# Altium project 03-LcdSegment.PrjPcb
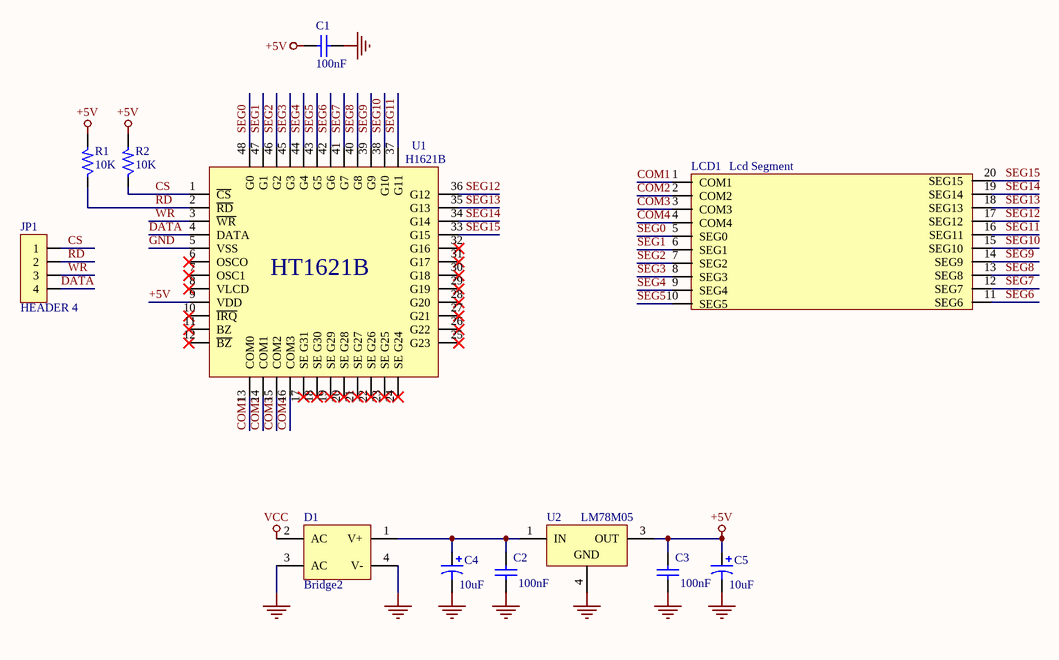
[diagram p0: 03-LcdSegment.SchDoc]
1 sheet, 12 parts. Net scope: global (net labels, ports and power ports of the same name join across sheets).
Board file: 03-LcdSegment.PcbDoc

## Sheet 03-LcdSegment.SchDoc
size A4

### Parts
C1  value 100nF  [RAD-0.3]  (hidden comment: 104)
C2  value 100nF  [RAD-0.3]  (hidden comment: 104)
C3  value 100nF  [RAD-0.3]  (hidden comment: 104)
C4  value 10uF  [RB7.6-15]  (hidden comment: 10uF/16V)
C5  value 10uF  [RB7.6-15]  (hidden comment: 10uF/16V)
D1  Bridge2  [D-46_6A]
JP1  HEADER 4  [JP4-C1T]
LCD1  Lcd Segment  [LCD_SEG_6]
R1  10K  [RES-0805]
R2  10K  [RES-0805]
U1  H1621B  [LQFP-48]
U2  value LM78M05  [NDP0003B_M]  (hidden comment: LM78M05CDTX)

### Nets
+5V: C1.1 C3.1 C5.1 R1.2 R2.2 U1.9(VDD) U2.3(OUT)
GND: C1.2 C2.2 C3.2 C4.2 C5.2 D1.3(AC) D1.4(V-) U1.5(VSS) U2.4(GND)
VCC: D1.2(AC)
COM1: LCD1.1(COM1) U1.13(COM0)
COM2: LCD1.2(COM2) U1.14(COM1)
COM3: LCD1.3(COM3) U1.15(COM2)
COM4: LCD1.4(COM4) U1.16(COM3)
CS: JP1.1 R2.1 U1.1(~{CS})
DATA: JP1.4 U1.4(DATA)
RD: JP1.2 R1.1 U1.2(~{RD})
SEG0: LCD1.5(SEG0) U1.48(G0)
SEG1: LCD1.6(SEG1) U1.47(G1)
SEG2: LCD1.7(SEG2) U1.46(G2)
SEG3: LCD1.8(SEG3) U1.45(G3)
SEG4: LCD1.9(SEG4) U1.44(G4)
SEG5: LCD1.10(SEG5) U1.43(G5)
SEG6: LCD1.11(SEG6) U1.42(G6)
SEG7: LCD1.12(SEG7) U1.41(G7)
SEG8: LCD1.13(SEG8) U1.40(G8)
SEG9: LCD1.14(SEG9) U1.39(G9)
SEG10: LCD1.15(SEG10) U1.38(G10)
SEG11: LCD1.16(SEG11) U1.37(G11)
SEG12: LCD1.17(SEG12) U1.36(G12)
SEG13: LCD1.18(SEG13) U1.35(G13)
SEG14: LCD1.19(SEG14) U1.34(G14)
SEG15: LCD1.20(SEG15) U1.33(G15)
WR: JP1.3 U1.3(~{WR})
NetC2_1: C2.1 C4.1 D1.1(V+) U2.1(IN)

Not connected (* = marked no-connect by the designer): U1 6(OSCO)* 7(OSC1)* 8(VLCD)* 10(~{IRQ})* 11(BZ)* 12(~{BZ})* 17(SE_G31)* 18(SE_G30)* 19(SE_G29)* 20(SE_G28)* 21(SE_G27)* 22(SE_G26)* 23(SE_G25)* 24(SE_G24)* 25(G23)* 26(G22)* 27(G21)* 28(G20)* 29(G19)* 30(G18)* 31(G17)* 32(G16)*

### Notes on the sheet
- (in symbol H1621B) HT1621B

### Library data of the parts
C1-C3 = Cap: Capacitor; Published: 8-Jun-2000; LatestRevisionDate: 17-Jul-2002; LatestRevisionNote: Re-released for DXP Platform.; PackageReference: RAD-0.3; Publisher: Altium Limited; PackageDescription: Radial Cap, Thru-Hole; 2 Leads; 0.3 in Pin Spacing
C4 C5 = Cap Pol1: Polarized Capacitor (Radial); Published: 8-Jun-2000; LatestRevisionDate: 17-Jul-2002; LatestRevisionNote: Re-released for DXP Platform.; PackageReference: RB7.6-15; Publisher: Altium Limited; PackageDescription: Polarized Capacitor (Radial); 2 Leads
D1 = Bridge2: Diode Bridge; Published: 24-Mar-1999; LatestRevisionDate: 17-Jul-2002; LatestRevisionNote: Re-released for DXP Platform.; PackageReference: D-46_6A; Publisher: Altium Limited; PackageDescription: Bridge Rectifier; 4 Terminals; Body 16.8 x 16.8 mm (typ); Pitch 10.67 mm
JP1 = JP4: WR-PHD 2.54 mm Angled Socket Header; Manufacturer: W¨¹rth Elektronik eiSos GmbH; partNo: 613004143121; ComponentLink1 Description: Manufacturer; ComponentLink2 Description: Datasheet; NoPins: 04; Created Date: 29 March 2013; ComponentLink1URL: http://www.we-online.com; ComponentLink2URL: http://katalog.we-online.de/em/datasheet/6130xx143121.pdf; Created by: Karrer Zheng
LCD1 = LCD_SEG
R1 R2 = Res1/4W
U2 = CMP-0062-00204-3: 3-Terminal Positive Voltage Regulators, 3-pin TO-252; Manufacturer: Texas Instruments; PackageTopMarking: NSUZXYTT*LM78M05*CDT; PowerWise: N; CompType: LDO IC; ComponentLink1Description: Datasheet URL; ComponentLink1URL: http://www.ti.com/general/docs/lit/getliterature.tsp?genericPartNumber=LM78M05&fileType=pdf; PackageReference: NDP0003B; Code_JEDEC: TO-252-AA; PinCount: 3; PackageDescription: TO252, Molded, Jedec, 6.8 x 6.10 x 2.30mm Body, 3 Lead, 2.28mm Pitch, Surface Mount